# Altium schematic sheet Relay_Outputs.SchDoc: Relay Outputs
size A4; CheckedBy: DMH; Organization: Detex Corp; Address1: Detex Corp; Address2: 302 Detex Dr; Address3: New Braunfels, TX 78130; Address4: (830) 629-290; DocumentNumber: 107027; Revision: A1; SheetNumber: 5; SheetTotal: 5; ProjectName: EE Project - 1.17.2021.PrjPcb
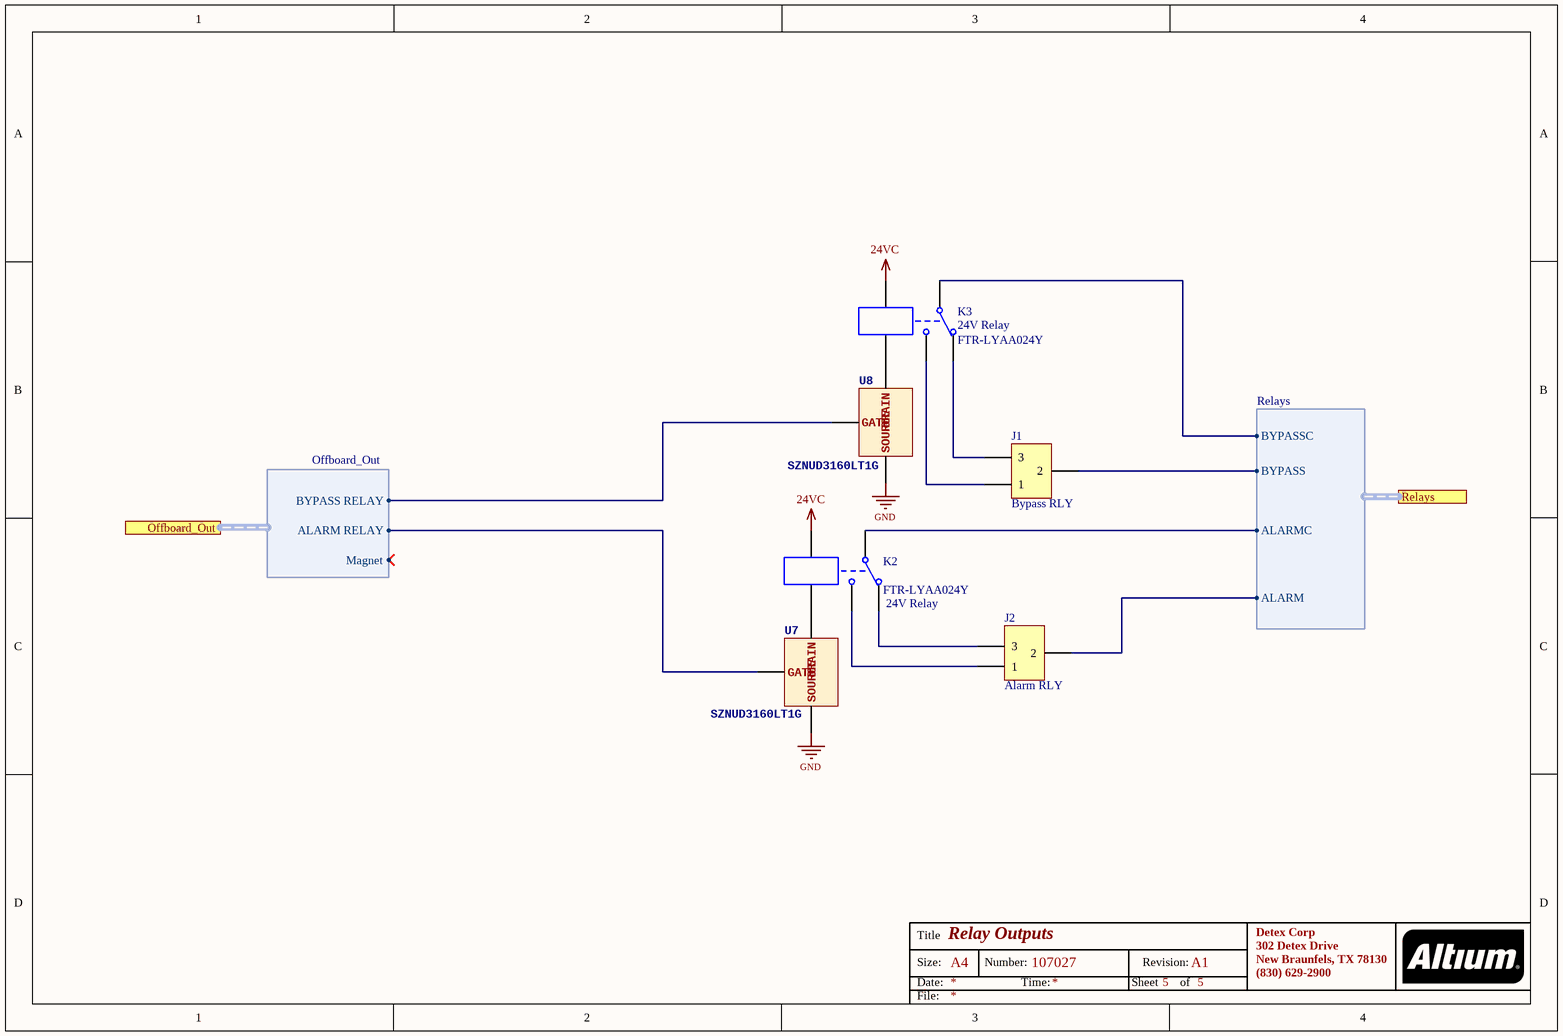
[diagram p0: Relay_Outputs.SchDoc]

## Parts
J1  Bypass RLY  [3 Pin Header for Relay]
J2  Alarm RLY  [3 Pin Header for Relay]
K2  24V Relay  MFR P/N: FTR-LYAA024Y  [FTR-LY]
K3  24V Relay  MFR P/N: FTR-LYAA024Y  [FTR-LY]
U7  SZNUD3160LT1G  [SOT-23_N]
U8  SZNUD3160LT1G  [SOT-23_N]

## Ports
Offboard_Out (harness Offboard_Out), Relays (harness Relays)

## Harnesses
Offboard_Out: ALARM RELAY, BYPASS RELAY, Magnet
Relays: ALARMC, ALARM, BYPASSC, BYPASS

## Nets
24VC: K2.4 K3.4
GND: U7.2(SOURCE) U8.2(SOURCE)
NetJ1_1: J1.1 K3.3(N/O)
NetJ1_2: J1.2 ; port Relays.BYPASS
NetJ1_3: J1.3 K3.2(N/C)
NetJ2_1: J2.1 K2.3(N/O)
NetJ2_2: J2.2 ; port Relays.ALARM
NetJ2_3: J2.3 K2.2(N/C)
NetK2_1: K2.1(COM) ; port Relays.ALARMC
NetK2_5: K2.5 U7.3(DRAIN)
NetK3_1: K3.1(COM) ; port Relays.BYPASSC
NetK3_5: K3.5 U8.3(DRAIN)
NetU7_1: U7.1(GATE) ; port Offboard_Out.ALARM RELAY
NetU8_1: U8.1(GATE) ; port Offboard_Out.BYPASS RELAY

## Notes on the sheet
- Title
- Size:
- Date:
- A4
- Number:
- Time:
- Sheet
- Revision:
- of
- Detex Corp
- 302 Detex Drive
- New Braunfels, TX 78130
- (830) 629-2900
- File:

## Library data of the parts
J1 J2 = Header 3: Header, 3-Pin; Detex P/N: *; ComponentLink1Description: Datasheet
K2 K3 = Relay-SPDT: SPST (1 Form A); MFR: Fujitsu; Detex P/N: 106224; ComponentLink1Description: Datasheet; Mounting Technology: Thru-Hole
  K2: ComponentLink1URL: http://www.rmorais.utad.pt/RMPDFFiles/PDFDatasheets/FTR-LY.pdf
U7 U8 = SZNUD3160LT1G: ON SEMICONDUCTOR - SZNUD3160LT1G - Relay Driver, Inductive Load, 61V to 70V Drain to Source, 150mA Out, SOT-23-3; Case/Package: SOT-23-3; Length: 3.04mm; Height: 1.01mm; ComponentLink1URL: https://datasheet.ciiva.com/11165/nud3160-d-11165392.pdf?src-supplier=Avnet; ComponentLink1Description: Datasheet; MFR: ON Semiconductor; MFR P/N: SZNUD3160LT1G; Mounting Technology: SMT; PACKAGE: SOT-23-3